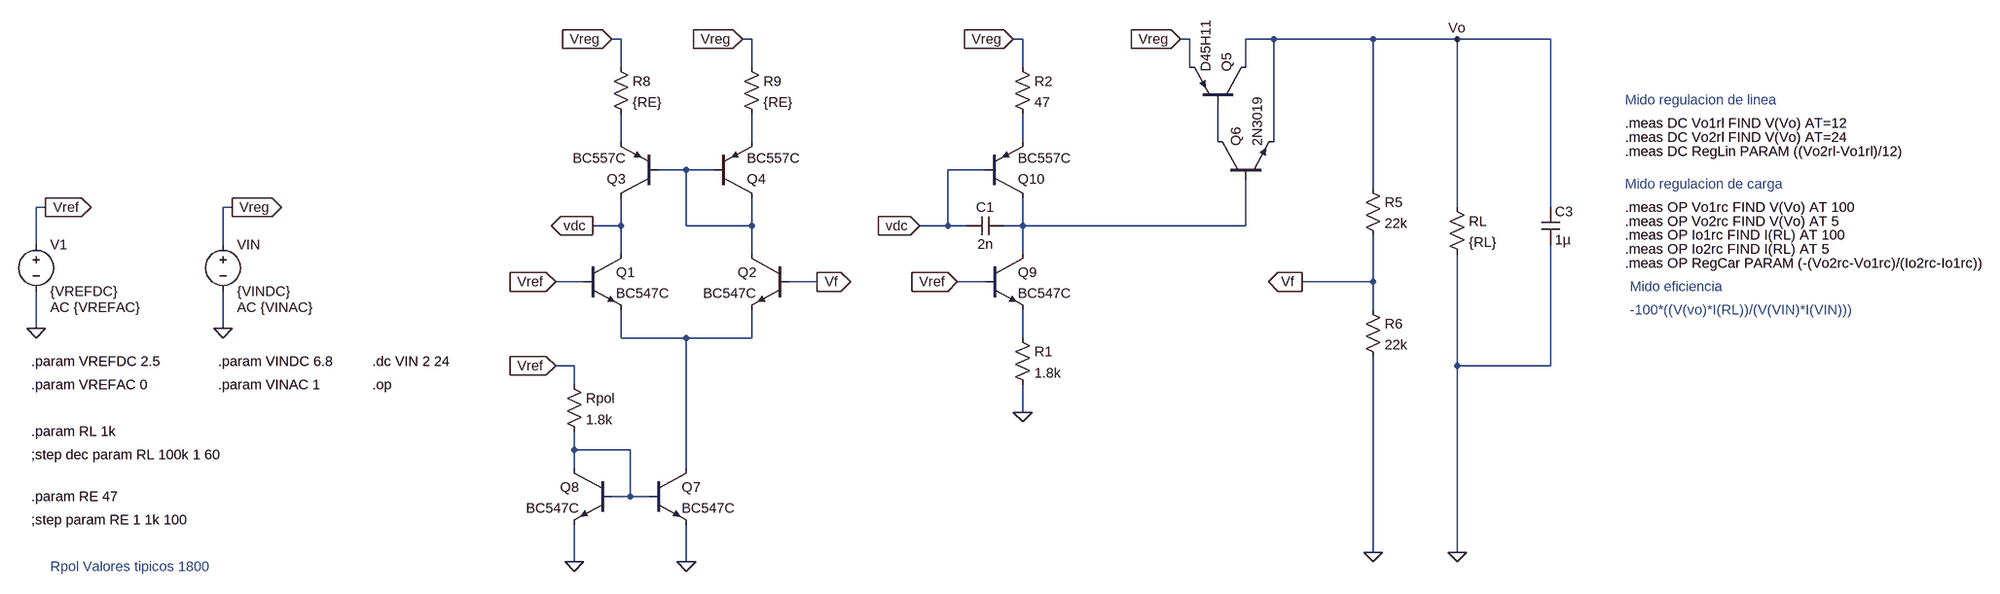
[diagram p0: schematic Version 1.5.asc]
Version 1.5.asc, the LTspice schematic file:
Version 4
SHEET 1 3148 1188
WIRE 96 -128 80 -128
WIRE 320 -128 304 -128
WIRE 784 -128 768 -128
WIRE 1152 -128 1136 -128
WIRE 1296 -128 1248 -128
WIRE 1616 -128 1296 -128
WIRE 1760 -128 1616 -128
WIRE 1920 -128 1760 -128
WIRE 96 -80 96 -128
WIRE 320 -80 320 -128
WIRE 784 -80 784 -128
WIRE 1152 -80 1152 -128
WIRE 1248 -80 1248 -128
WIRE 96 48 96 0
WIRE 320 48 320 0
WIRE 784 48 784 0
WIRE 1200 48 1200 -16
WIRE 1296 48 1296 -128
WIRE 208 96 160 96
WIRE 256 96 208 96
WIRE 720 96 656 96
WIRE 1616 128 1616 -128
WIRE -1008 160 -1024 160
WIRE -688 160 -704 160
WIRE 1760 160 1760 -128
WIRE 1920 160 1920 -128
WIRE 96 192 96 144
WIRE 96 192 48 192
WIRE 208 192 208 96
WIRE 320 192 320 144
WIRE 320 192 208 192
WIRE 656 192 656 96
WIRE 656 192 608 192
WIRE 688 192 656 192
WIRE 784 192 784 144
WIRE 784 192 752 192
WIRE 1248 192 1248 112
WIRE 1248 192 784 192
WIRE -1024 224 -1024 160
WIRE -704 224 -704 160
WIRE 96 240 96 192
WIRE 320 240 320 192
WIRE 784 240 784 192
WIRE 32 288 -16 288
WIRE 432 288 384 288
WIRE 720 288 672 288
WIRE 1616 288 1616 208
WIRE 1616 288 1344 288
WIRE 1616 336 1616 288
WIRE -1024 368 -1024 304
WIRE -704 368 -704 304
WIRE 96 384 96 336
WIRE 208 384 96 384
WIRE 320 384 320 336
WIRE 320 384 208 384
WIRE 784 384 784 336
WIRE 16 432 -16 432
WIRE 1760 432 1760 240
WIRE 1920 432 1920 224
WIRE 1920 432 1760 432
WIRE 16 464 16 432
WIRE 784 512 784 464
WIRE 16 576 16 544
WIRE 112 576 16 576
WIRE 16 608 16 576
WIRE 208 608 208 384
WIRE 112 656 112 576
WIRE 112 656 80 656
WIRE 144 656 112 656
WIRE 1616 752 1616 416
WIRE 1760 752 1760 432
WIRE 16 768 16 704
WIRE 208 768 208 704
FLAG 1760 -128 Vo
FLAG -1008 160 Vref
IOPIN -1008 160 Out
FLAG 1344 288 Vf
IOPIN 1344 288 Out
FLAG -1024 368 0
FLAG -688 160 Vreg
IOPIN -688 160 Out
FLAG 1760 752 0
FLAG 1616 752 0
FLAG -16 288 Vref
IOPIN -16 288 In
FLAG -16 432 Vref
IOPIN -16 432 In
FLAG -704 368 0
FLAG 16 768 0
FLAG 208 768 0
FLAG 80 -128 Vreg
IOPIN 80 -128 In
FLAG 304 -128 Vreg
IOPIN 304 -128 In
FLAG 1136 -128 Vreg
IOPIN 1136 -128 In
FLAG 768 -128 Vreg
IOPIN 768 -128 In
FLAG 672 288 Vref
IOPIN 672 288 In
FLAG 784 512 0
FLAG 608 192 vdc
IOPIN 608 192 In
FLAG 432 288 Vf
IOPIN 432 288 Out
FLAG 48 192 vdc
IOPIN 48 192 Out
DATAFLAG 1920 -112 ""
DATAFLAG 16 288 ""
DATAFLAG 368 192 ""
DATAFLAG 224 96 ""
DATAFLAG 320 32 ""
DATAFLAG 784 -128 ""
DATAFLAG 816 192 ""
DATAFLAG 784 16 ""
SYMBOL pnp 160 144 R180
SYMATTR InstName Q3
SYMATTR Value BC557C
SYMBOL pnp 256 144 M180
SYMATTR InstName Q4
SYMATTR Value BC557C
SYMBOL npn 32 240 R0
SYMATTR InstName Q1
SYMATTR Value BC547C
SYMBOL npn 384 240 M0
SYMATTR InstName Q2
SYMATTR Value BC547C
SYMBOL pnp 1248 -16 M270
SYMATTR InstName Q5
SYMATTR Value D45H11
SYMBOL npn 1200 112 R270
SYMATTR InstName Q6
SYMATTR Value 2N3019
SYMBOL res 1600 112 R0
SYMATTR InstName R5
SYMATTR Value 22k
SYMBOL res 1600 320 R0
SYMATTR InstName R6
SYMATTR Value 22k
SYMBOL res 1744 144 R0
SYMATTR InstName RL
SYMATTR Value {RL}
SYMBOL voltage -1024 208 R0
WINDOW 123 24 124 Left 2
WINDOW 39 0 0 Left 0
SYMATTR Value2 AC {VREFAC}
SYMATTR InstName V1
SYMATTR Value {VREFDC}
SYMBOL res 80 -96 R0
SYMATTR InstName R8
SYMATTR Value {RE}
SYMBOL res 304 -96 R0
SYMATTR InstName R9
SYMATTR Value {RE}
SYMBOL cap 1904 160 R0
SYMATTR InstName C3
SYMATTR Value 1µ
SYMBOL voltage -704 208 R0
WINDOW 123 24 124 Left 2
WINDOW 39 0 0 Left 0
SYMATTR Value2 AC {VINAC}
SYMATTR InstName VIN
SYMATTR Value {VINDC}
SYMBOL npn 144 608 R0
SYMATTR InstName Q7
SYMATTR Value BC547C
SYMBOL npn 80 608 M0
SYMATTR InstName Q8
SYMATTR Value BC547C
SYMBOL res 0 448 R0
SYMATTR InstName Rpol
SYMATTR Value 1.8k
SYMBOL cap 752 176 R90
WINDOW 0 0 32 VBottom 2
WINDOW 3 32 32 VTop 2
SYMATTR InstName C1
SYMATTR Value 2n
SYMBOL npn 720 240 R0
SYMATTR InstName Q9
SYMATTR Value BC547C
SYMBOL res 768 368 R0
SYMATTR InstName R1
SYMATTR Value 1.8k
SYMBOL res 768 -96 R0
SYMATTR InstName R2
SYMATTR Value 47
SYMBOL pnp 720 144 M180
SYMATTR InstName Q10
SYMATTR Value BC557C
TEXT -448 464 Left 2 !.op
TEXT -712 424 Left 2 !.param VINDC 6.8
TEXT -712 464 Left 2 !.param VINAC 1
TEXT -1032 424 Left 2 !.param VREFDC 2.5
TEXT -1032 464 Left 2 !.param VREFAC 0
TEXT -1032 544 Left 2 !.param RL 1k
TEXT -448 424 Left 2 !.dc VIN 2 24
TEXT -1032 696 Left 2 !;step param RE 1 1k 100
TEXT -1032 656 Left 2 !.param RE 47
TEXT -1032 584 Left 2 !;step dec param RL 100k 1 60
TEXT 2048 -24 Left 2 ;Mido regulacion de linea
TEXT 2048 16 Left 2 !.meas DC Vo1rl FIND V(Vo) AT=12
TEXT 2048 40 Left 2 !.meas DC Vo2rl FIND V(Vo) AT=24
TEXT 2048 64 Left 2 !.meas DC RegLin PARAM ((Vo2rl-Vo1rl)/12)
TEXT 2048 120 Left 2 ;Mido regulacion de carga
TEXT 2048 160 Left 2 !.meas OP Vo1rc FIND V(Vo) AT 100
TEXT 2048 184 Left 2 !.meas OP Vo2rc FIND V(Vo) AT 5
TEXT 2048 208 Left 2 !.meas OP Io1rc FIND I(RL) AT 100
TEXT 2048 232 Left 2 !.meas OP Io2rc FIND I(RL) AT 5
TEXT 2056 296 Left 2 ;Mido eficiencia
TEXT 2056 336 Left 2 ;-100*((V(vo)*I(RL))/(V(VIN)*I(VIN)))
TEXT 2048 256 Left 2 !.meas OP RegCar PARAM (-(Vo2rc-Vo1rc)/(Io2rc-Io1rc))
TEXT -1000 776 Left 2 ;Rpol Valores tipicos 1800

The netlist it stands for:
* Version 1.5.asc
Q3 vdc N005 N001 0 BC557C
Q4 N005 N005 N002 0 BC557C
Q1 vdc Vref N007 0 BC547C
Q2 N005 Vf N007 0 BC547C
Q5 Vo N004 Vreg 0 D45H11
Q6 N004 N006 Vo 0 2N3019
R5 Vo Vf 22k
R6 Vf 0 22k
RL Vo 0 {RL}
V1 Vref 0 {VREFDC} AC {VREFAC}
R8 Vreg N001 {RE}
R9 Vreg N002 {RE}
C3 Vo 0 1µ
VIN Vreg 0 {VINDC} AC {VINAC}
Q7 N007 N009 0 0 BC547C
Q8 N009 N009 0 0 BC547C
Rpol Vref N009 1.8k
C1 N006 vdc 2n
Q9 N006 Vref N008 0 BC547C
R1 N008 0 1.8k
R2 Vreg N003 47
Q10 N006 vdc N003 0 BC557C
.model NPN NPN
.model PNP PNP
.lib standard.bjt
.op
.param VINDC 6.8
.param VINAC 1
.param VREFDC 2.5
.param VREFAC 0
.param RL 1k
.dc VIN 2 24
;step param RE 1 1k 100
.param RE 47
;step dec param RL 100k 1 60
* Mido regulacion de linea
.meas DC Vo1rl FIND V(Vo) AT=12
.meas DC Vo2rl FIND V(Vo) AT=24
.meas DC RegLin PARAM ((Vo2rl-Vo1rl)/12)
* Mido regulacion de carga
.meas OP Vo1rc FIND V(Vo) AT 100
.meas OP Vo2rc FIND V(Vo) AT 5
.meas OP Io1rc FIND I(RL) AT 100
.meas OP Io2rc FIND I(RL) AT 5
* Mido eficiencia
* -100*((V(vo)*I(RL))/(V(VIN)*I(VIN)))
.meas OP RegCar PARAM (-(Vo2rc-Vo1rc)/(Io2rc-Io1rc))
* Rpol Valores tipicos 1800
.backanno
.end